# Altium project RS_RF02.PrjPcb
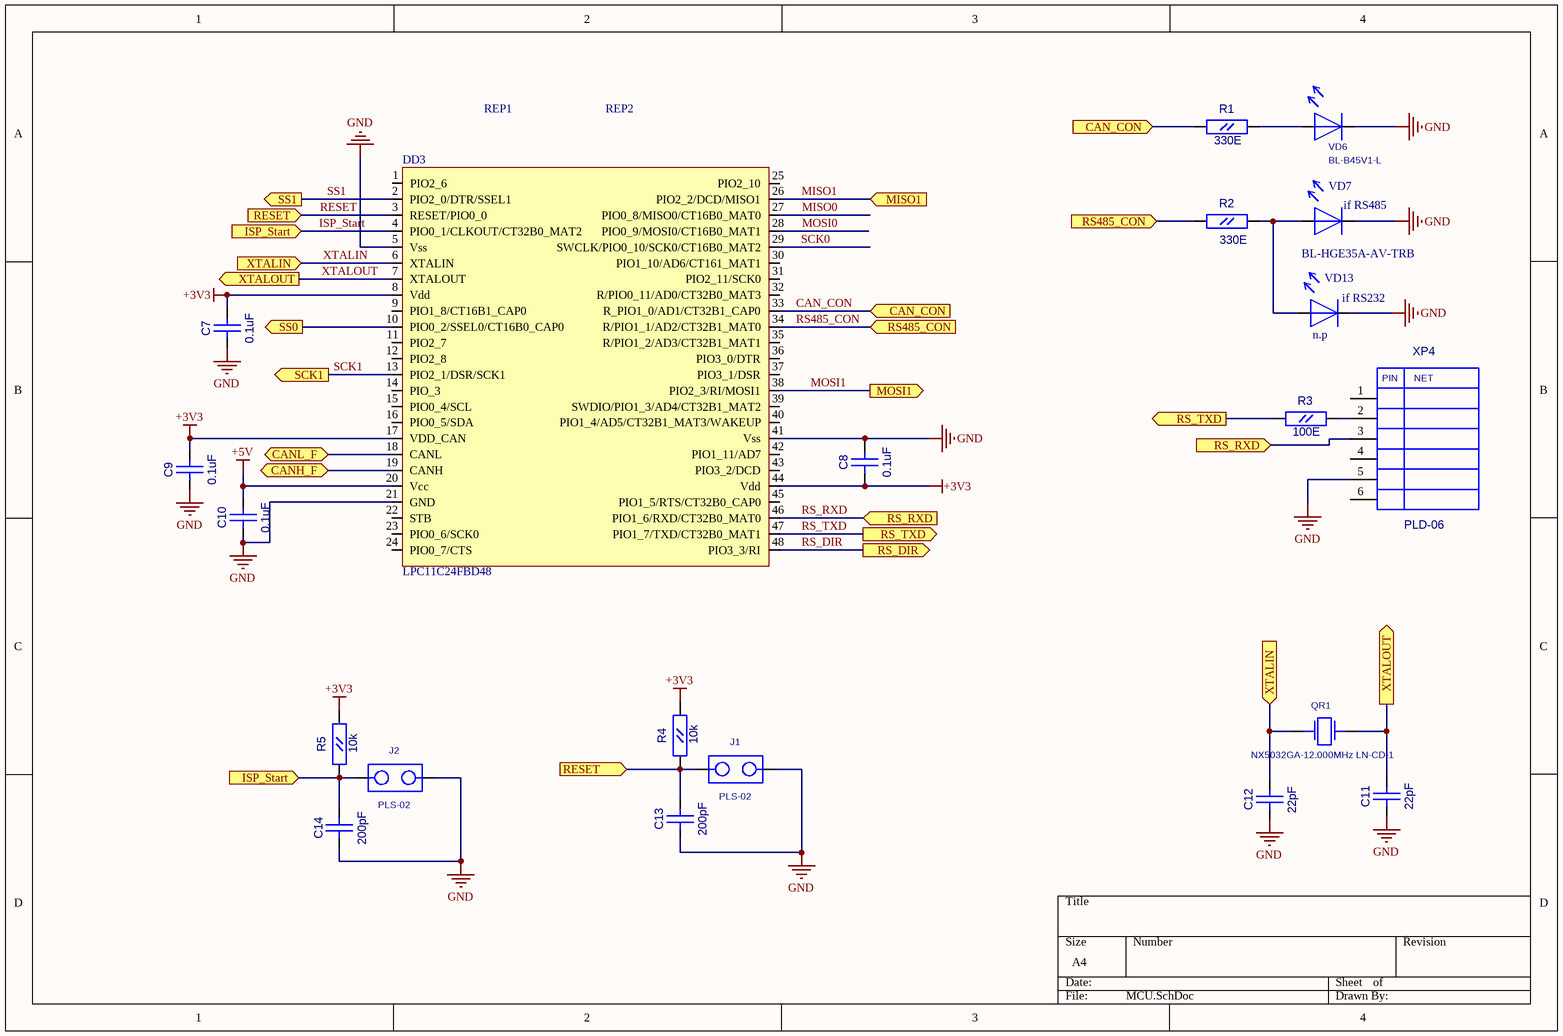
[diagram p0: MCU.SchDoc]
1 sheet, 23 parts. Net scope: flat (ports and power ports of the same name join across sheets).
Board file: RS_RF02.PcbDoc

## Sheet MCU.SchDoc
size A4

### Parts
C7  0.1uF  [CC0603]
C8  0.1uF  [CC0603]
C9  0.1uF  [CC0603]
C10  0.1uF  [CC0603]
C11  22pF  [CC0603]
C12  22pF  [CC0603]
C13  200pF  [CC0603]
C14  200pF  [CC0603]
DD3  LPC11C24FBD48  [LQFP-48]
J1  PLS-02  [PLS-02]
J2  PLS-02  [PLS-02]
QR1  NX5032GA-12.000MHz LN-CD-1  [AC5032_2]
R1  330E  [RC0603]
R2  330E  [RC0603]
R3  100E  [RC0603]
R4  10k  [RC0603]
R5  10k  [RC0603]
REP1  REPER_POINT_1.2  [REPER1.2]  (value not drawn)
REP2  REPER_POINT_1.2  [REPER1.2]  (value not drawn)
VD6  BL-B45V1-L  [LED3]
VD7  BL-HGE35A-AV-TRB  [LED0805]
VD13  n.p  [LED0805]
XP4  PLD-06  [PIN6]

### Ports
CAN_CON (in), CANH_F, CANL_F, ISP_Start (in), MISO1 (in), MOSI1 (out), RESET (in), RS485_CON (in), RS_DIR (out), RS_RXD (in), RS_TXD (out), SCK1 (out), SS0 (out), SS1 (out), XTALIN (in), XTALOUT (out)

### Nets
+3V3: C7.2(B) C8.1(A) C9.2(B) DD3.8(Vdd) DD3.17(VDD_CAN) DD3.44(Vdd) R4.2(B) R5.2(B)
+5V: C10.2(B) DD3.20(Vcc)
GND: C7.1(A) C8.2(B) C9.1(A) C10.1(A) C11.1(A) C12.1(A) C13.1(A) C14.1(A) DD3.5(Vss) DD3.21(GND) DD3.41(Vss) J1.2 J2.2 VD6.1 VD7.2 VD13.2 XP4.5
CAN_CON: DD3.33(R_PIO1_0/AD1/CT32B1_CAP0) R1.1(A) ; port CAN_CON
ISP_Start: C14.2(B) DD3.4(PIO0_1/CLKOUT/CT32B0_MAT2) J2.1 R5.1(A) ; port ISP_Start
MISO0: DD3.27(PIO0_8/MISO0/CT16B0_MAT0)
MISO1: DD3.26(PIO2_2/DCD/MISO1) ; port MISO1
MOSI0: DD3.28(PIO0_9/MOSI0/CT16B0_MAT1)
MOSI1: DD3.38(PIO2_3/RI/MOSI1) ; port MOSI1
RESET: C13.2(B) DD3.3(RESET/PIO0_0) J1.1 R4.1(A) ; port RESET
RS485_CON: DD3.34(R/PIO1_1/AD2/CT32B1_MAT0) R2.1(A) ; port RS485_CON
RS_DIR: DD3.48(PIO3_3/RI) ; port RS_DIR
RS_RXD: DD3.46(PIO1_6/RXD/CT32B0_MAT0) XP4.3 ; port RS_RXD
RS_TXD: DD3.47(PIO1_7/TXD/CT32B0_MAT1) R3.1(A) ; port RS_TXD
SCK0: DD3.29(SWCLK/PIO0_10/SCK0/CT16B0_MAT2)
SCK1: DD3.13(PIO2_1/DSR/SCK1) ; port SCK1
SS1: DD3.2(PIO2_0/DTR/SSEL1) ; port SS1
XTALIN: C12.2(B) DD3.6(XTALIN) QR1.1 ; port XTALIN
XTALOUT: C11.2(B) DD3.7(XTALOUT) QR1.2 ; port XTALOUT
NetDD3_10: DD3.10(PIO0_2/SSEL0/CT16B0_CAP0) ; port SS0
NetDD3_18: DD3.18(CANL) ; port CANL_F
NetDD3_19: DD3.19(CANH) ; port CANH_F
NetR1_2: R1.2(B) VD6.2
NetR2_2: R2.2(B) VD7.1 VD13.1
NetR3_2: R3.2(B) XP4.2

Not connected (* = marked no-connect by the designer): DD3 1(PIO2_6) 9(PIO1_8/CT16B1_CAP0) 11(PIO2_7) 12(PIO2_8) 14(PIO_3) 15(PIO0_4/SCL) 16(PIO0_5/SDA) 22(STB) 23(PIO0_6/SCK0) 24(PIO0_7/CTS) 25(PIO2_10) 30(PIO1_10/AD6/CT161_MAT1) 31(PIO2_11/SCK0) 32(R/PIO0_11/AD0/CT32B0_MAT3) 35(R/PIO1_2/AD3/CT32B1_MAT1) 36(PIO3_0/DTR) 37(PIO3_1/DSR) 39(SWDIO/PIO1_3/AD4/CT32B1_MAT2) 40(PIO1_4/AD5/CT32B1_MAT3/WAKEUP) 42(PIO1_11/AD7) 43(PIO3_2/DCD) 45(PIO1_5/RTS/CT32B0_CAP0); REP1 1; REP2 1; XP4 1 4 6

### Notes on the sheet
- (near VD7) if RS485
- (near VD13) if RS232
- (in symbol PLD-06) PIN; NET

### Library data of the parts
C7-C14 = CC0603
  C7-C10: Value: 0.1uF
  C11 C12: Value: 22pF
  C13 C14: Value: 200pF
QR1 = AC5032_2: AC5032/2; Value: NX5032GA-12.000MHz LN-CD-1
R1-R5 = RC0603
  R1 R2: Value: 330E
  R3: Value: 100E
  R4 R5: Value: 10k
REP1 REP2 = REPER1.2: Value: REPER_POINT_1.2
VD6 = LED_3: Value: BL-B45V1-L
VD7 VD13 = LED_0805
  VD7: Value: BL-HGE35A-AV-TRB
  VD13: Value: n.p
XP4 = PLD-06: PLD06; Value: *
DD3 = LPC11C24FBD48: Value: LPC11C24FBD48
J1 J2 = PLS-02: Value: *